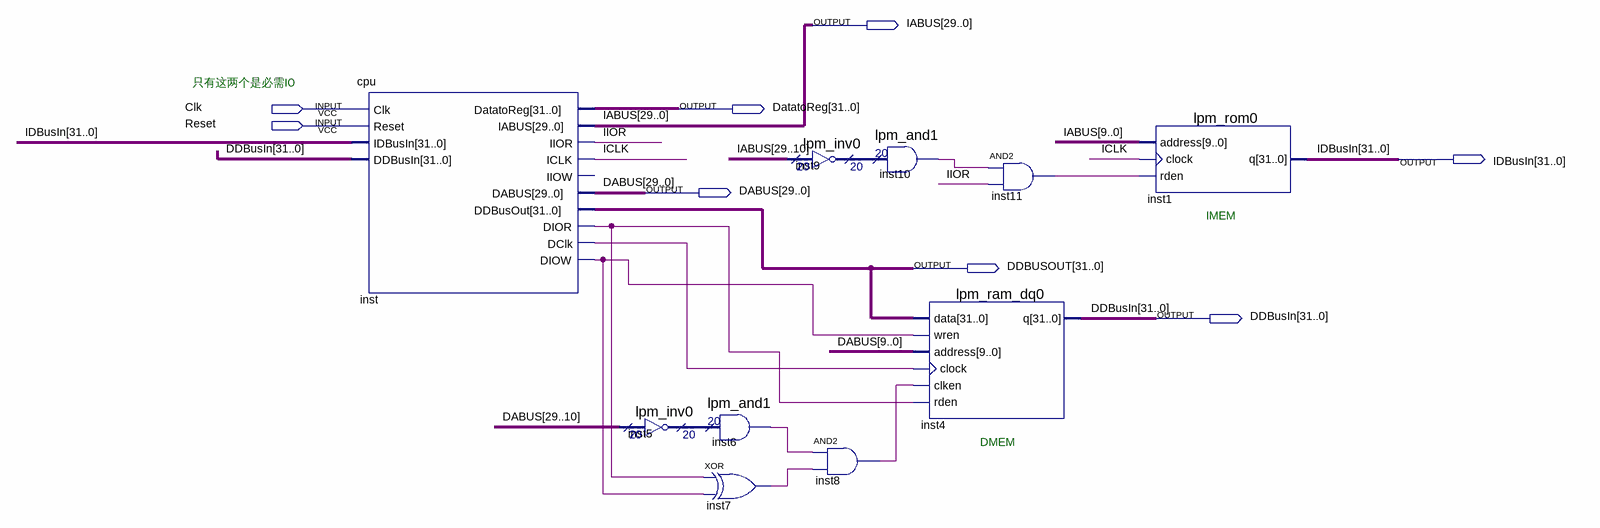
[diagram p0: schematic sheet]
// Quartus schematic computer.bdf as structural Verilog: 10 symbols, 8 pins
module computer (
  input  Clk,
  input  Reset,
  output [29:0] IABUS,
  output [31:0] DatatoReg,
  output [31:0] IDBusIn,
  output [29:0] DABUS,
  output [31:0] DDBUSOUT,
  output [31:0] DDBusIn
);

  wire ICLK, IIOR, inst6_result, inst7_out, inst8_out, inst10_result, inst11_out, inst_dclk, inst_dior,
       inst_diow;
  wire [19:0] inst5_result, inst9_result;

  cpu inst (
    .Clk(Clk), .Reset(Reset), .IDBusIn(IDBusIn), .DDBusIn(DDBusIn), .DatatoReg(DatatoReg), .IABUS(IABUS),
    .IIOR(IIOR), .ICLK(ICLK), .DABUS(DABUS), .DDBusOut(DDBUSOUT), .DIOR(inst_dior), .DClk(inst_dclk),
    .DIOW(inst_diow));  // open: IIOW
  lpm_inv0 inst5 (.data(DABUS[29:10]), .result(inst5_result));
  lpm_and1 inst6 (.data(inst5_result), .result(inst6_result));
  xor inst7 (inst7_out, inst_dior, inst_diow);
  lpm_inv0 inst9 (.data(IABUS[29:10]), .result(inst9_result));
  lpm_and1 inst10 (.data(inst9_result), .result(inst10_result));
  and inst8 (inst8_out, inst6_result, inst7_out);
  lpm_ram_dq0 inst4 (
    .data(DDBUSOUT), .wren(inst_diow), .address(DABUS[9:0]), .clock(inst_dclk), .clken(inst8_out),
    .rden(inst_dior), .q(DDBusIn));
  and inst11 (inst11_out, inst10_result, IIOR);
  lpm_rom0 inst1 (.address(IABUS[9:0]), .clock(ICLK), .rden(inst11_out), .q(IDBusIn));

  // Notes on the sheet:
  //   只有这两个是必需IO
  //   IMEM
  //   DMEM
endmodule
